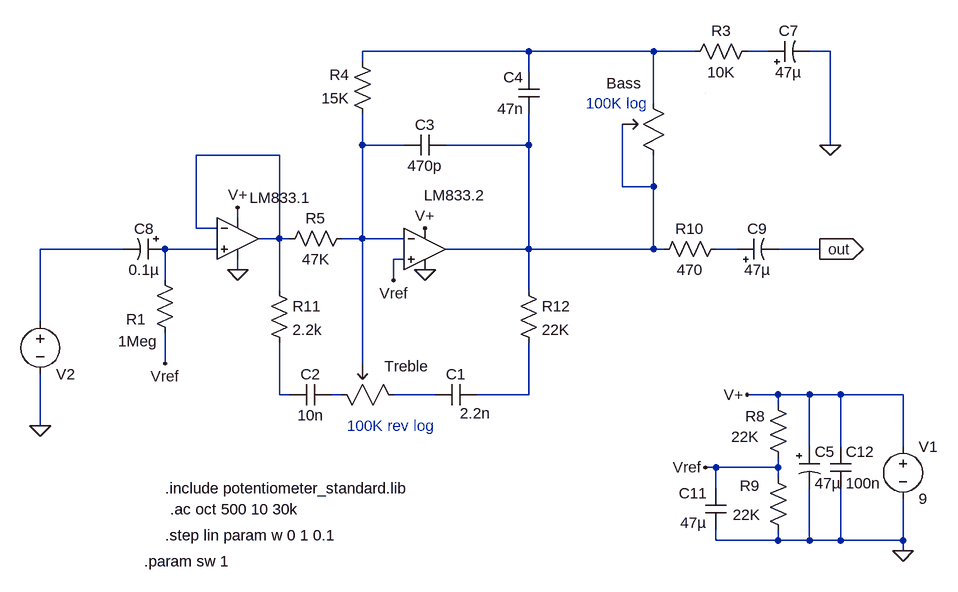
[diagram p0: schematic funky_dude_2eq_v2.0.asc]
funky_dude_2eq_v2.0.asc, the LTspice schematic file:
Version 4
SHEET 1 1644 972
WIRE -256 -240 -512 -240
WIRE -64 -240 -256 -240
WIRE 0 -240 -64 -240
WIRE 112 -240 80 -240
WIRE 208 -240 176 -240
WIRE -512 -224 -512 -240
WIRE -256 -208 -256 -240
WIRE -64 -160 -64 -240
WIRE -512 -96 -512 -144
WIRE -448 -96 -512 -96
WIRE -256 -96 -256 -144
WIRE -256 -96 -384 -96
WIRE 208 -96 208 -240
WIRE -640 -80 -768 -80
WIRE -112 -32 -112 -128
WIRE -64 -32 -64 -80
WIRE -64 -32 -112 -32
WIRE -704 16 -704 0
WIRE -768 32 -768 -80
WIRE -736 32 -768 32
WIRE -640 48 -640 -80
WIRE -640 48 -672 48
WIRE -624 48 -640 48
WIRE -512 48 -512 -96
WIRE -512 48 -544 48
WIRE -448 48 -512 48
WIRE -880 64 -1008 64
WIRE -736 64 -816 64
WIRE -256 64 -256 -96
WIRE -256 64 -384 64
WIRE -64 64 -64 -32
WIRE -64 64 -256 64
WIRE -48 64 -64 64
WIRE 64 64 32 64
WIRE 192 64 128 64
WIRE -448 80 -464 80
WIRE -704 96 -704 80
WIRE -816 112 -816 64
WIRE -464 112 -464 80
WIRE -640 128 -640 48
WIRE -256 128 -256 64
WIRE -1008 176 -1008 64
WIRE -816 240 -816 192
WIRE -512 240 -512 48
WIRE -640 288 -640 208
WIRE -624 288 -640 288
WIRE -544 288 -560 288
WIRE -400 288 -464 288
WIRE -256 288 -256 208
WIRE -256 288 -336 288
WIRE 128 288 80 288
WIRE 176 288 128 288
WIRE 224 288 176 288
WIRE 320 288 224 288
WIRE 128 304 128 288
WIRE -1008 336 -1008 256
WIRE 176 368 176 288
WIRE 224 368 224 288
WIRE 320 368 320 288
WIRE 32 400 16 400
WIRE 128 400 128 384
WIRE 128 400 32 400
WIRE 128 416 128 400
WIRE 32 432 32 400
WIRE 32 512 32 496
WIRE 128 512 128 496
WIRE 128 512 32 512
WIRE 176 512 176 432
WIRE 176 512 128 512
WIRE 224 512 224 432
WIRE 224 512 176 512
WIRE 320 512 320 448
WIRE 320 512 224 512
WIRE 320 528 320 512
FLAG 192 64 out
IOPIN 192 64 Out
FLAG 80 288 V+
FLAG -416 32 V+
FLAG 320 528 0
FLAG 208 -96 0
FLAG -1008 336 0
FLAG -704 0 V+
FLAG 16 400 Vref
FLAG -464 112 Vref
FLAG -816 240 Vref
FLAG -704 96 0
FLAG -416 96 0
SYMBOL res -16 -224 R270
WINDOW 0 32 56 VTop 2
WINDOW 3 0 56 VBottom 2
SYMATTR InstName R3
SYMATTR Value 10K
SYMBOL res -496 -128 R180
WINDOW 0 36 76 Left 2
WINDOW 3 36 40 Left 2
SYMATTR InstName R4
SYMATTR Value 15K
SYMBOL res -640 64 R270
WINDOW 0 32 56 VTop 2
WINDOW 3 0 56 VBottom 2
SYMATTR InstName R5
SYMATTR Value 47K
SYMBOL cap -336 272 R90
WINDOW 0 0 32 VBottom 2
WINDOW 3 29 2 VTop 2
SYMATTR InstName C1
SYMATTR Value 2.2n
SYMBOL cap -560 272 R90
WINDOW 0 0 32 VBottom 2
WINDOW 3 32 32 VTop 2
SYMATTR InstName C2
SYMATTR Value 10n
SYMBOL cap -384 -112 R90
WINDOW 0 0 32 VBottom 2
WINDOW 3 32 32 VTop 2
SYMATTR InstName C3
SYMATTR Value 470p
SYMBOL cap -240 -144 R180
WINDOW 0 24 56 Left 2
WINDOW 3 24 8 Left 2
SYMATTR InstName C4
SYMATTR Value 47n
SYMBOL polcap 160 368 R0
SYMATTR InstName C5
SYMATTR Value 47µ
SYMBOL polcap 112 -224 R270
WINDOW 0 32 32 VTop 2
WINDOW 3 0 32 VBottom 2
SYMATTR InstName C7
SYMATTR Value 47µ
SYMBOL polcap -816 48 R90
WINDOW 0 0 32 VBottom 2
WINDOW 3 32 32 VTop 2
SYMATTR InstName C8
SYMATTR Value 0.1µ
SYMBOL polcap 64 80 R270
WINDOW 0 32 32 VTop 2
WINDOW 3 0 32 VBottom 2
SYMATTR InstName C9
SYMATTR Value 47µ
SYMBOL voltage 320 352 R0
WINDOW 123 0 0 Left 2
WINDOW 39 0 0 Left 2
SYMATTR InstName V1
SYMATTR Value 9
SYMBOL voltage -1008 160 R0
WINDOW 0 39 81 Top 2
WINDOW 3 -60 137 Invisible 2
SYMATTR InstName V2
SYMATTR Value SINE(0 0.01 1000)
SYMATTR Value2 AC 1
SYMATTR SpiceLine Rser=7000
SYMBOL potentiometer_standard -48 -64 R180
WINDOW 39 -68 218 Invisible 2
WINDOW 38 48 41 Invisible 2
WINDOW 0 35 127 Left 2
WINDOW 3 -91 255 Invisible 2
SYMATTR SpiceLine Rtap=10k tap=0.5
SYMATTR SpiceModel pot_radiohm_plog
SYMATTR InstName Bass
SYMATTR Value Rtot=100K wiper={w}
SYMBOL potentiometer_standard -448 304 M270
WINDOW 38 48 41 Invisible 2
WINDOW 39 48 112 Invisible 2
WINDOW 0 60 30 VLeft 2
WINDOW 3 -22 212 Invisible 2
SYMATTR SpiceModel pot_nlog
SYMATTR SpiceLine Rtap=10k tap=0.5
SYMATTR InstName Treble
SYMATTR Value Rtot=100K wiper=1-{w}
SYMBOL Opamps\\UniversalOpamp2 -416 64 R0
WINDOW 0 -1 -83 Left 2
SYMATTR InstName LM833.2
SYMBOL Opamps\\UniversalOpamp2 -704 48 R0
WINDOW 0 18 -63 Left 2
SYMATTR InstName LM833.1
SYMBOL res -832 96 R0
WINDOW 0 -44 76 Left 2
WINDOW 3 -56 110 Left 2
SYMATTR InstName R1
SYMATTR Value 1Meg
SYMBOL res 112 288 R0
WINDOW 0 -35 33 Left 2
WINDOW 3 -56 65 Left 2
SYMATTR InstName R8
SYMATTR Value 22K
SYMBOL res 112 400 R0
WINDOW 0 -43 28 Left 2
WINDOW 3 -54 73 Left 2
SYMATTR InstName R9
SYMATTR Value 22K
SYMBOL cap 16 432 R0
WINDOW 0 -41 8 Left 2
WINDOW 3 -39 53 Left 2
SYMATTR InstName C11
SYMATTR Value 47µ
SYMBOL cap 208 368 R0
SYMATTR InstName C12
SYMATTR Value 100n
SYMBOL res -656 112 R0
SYMATTR InstName R11
SYMATTR Value 2.2k
SYMBOL res -272 112 R0
SYMATTR InstName R12
SYMATTR Value 22K
SYMBOL res -64 80 R270
WINDOW 0 32 56 VTop 2
WINDOW 3 0 56 VBottom 2
SYMATTR InstName R10
SYMATTR Value 470
TEXT -808 464 Left 2 !.ac oct 500 10 30k
TEXT -816 432 Left 2 !.include potentiometer_standard.lib
TEXT -816 504 Left 2 !.step lin param w 0 1 0.1
TEXT -536 336 Left 2 ;100K rev log
TEXT -848 544 Left 2 !.param sw 1
TEXT -168 -160 Left 2 ;100K log
LINE Normal 16 -176 16 -176 1

The netlist it stands for:
* funky_dude_2eq_v2.0.asc
R3 N001 N002 10K
R4 N003 N001 15K
R5 N005 N003 47K
C1 N012 N011 2.2n
C2 N010 N009 10n
C3 N004 N003 470p
C4 N004 N001 47n
C5 V+ 0 47µ
C7 N002 0 47µ
C8 N007 N006 0.1µ
C9 N008 out 47µ
V1 V+ 0 9
V2 N006 0 SINE(0 0.01 1000) AC 1 Rser=7000
XBass N004 N001 N004 pot_radiohm_plog Rtot=100K wiper={w} Rtap=10k tap=0.5  ; pins A B C
XTreble N011 N010 N003 pot_nlog Rtot=100K wiper=1-{w} Rtap=10k tap=0.5  ; pins A B C
XLM833.2 Vref N003 V+ 0 N004 level.2 Avol=1Meg GBW=10Meg Slew=10Meg ilimit=25m rail=0 Vos=0 phimargin=45 en=0 enk=0 in=0 ink=0 Rin=500Meg  ; pins IN+ IN- V+ V- OUT
XLM833.1 N007 N005 V+ 0 N005 level.2 Avol=1Meg GBW=10Meg Slew=10Meg ilimit=25m rail=0 Vos=0 phimargin=45 en=0 enk=0 in=0 ink=0 Rin=500Meg  ; pins IN+ IN- V+ V- OUT
R1 N007 Vref 1Meg
R8 V+ Vref 22K
R9 Vref 0 22K
C11 Vref 0 47µ
C12 V+ 0 100n
R11 N005 N009 2.2k
R12 N004 N012 22K
R10 N004 N008 470
.ac oct 500 10 30k
.include potentiometer_standard.lib
.step lin param w 0 1 0.1
* 100K rev log
.param sw 1
* 100K log
.lib UniversalOpamps2.sub
.backanno
.end